# EAGLE schematic project arm stm32f103 (EAGLE 7.1.0)
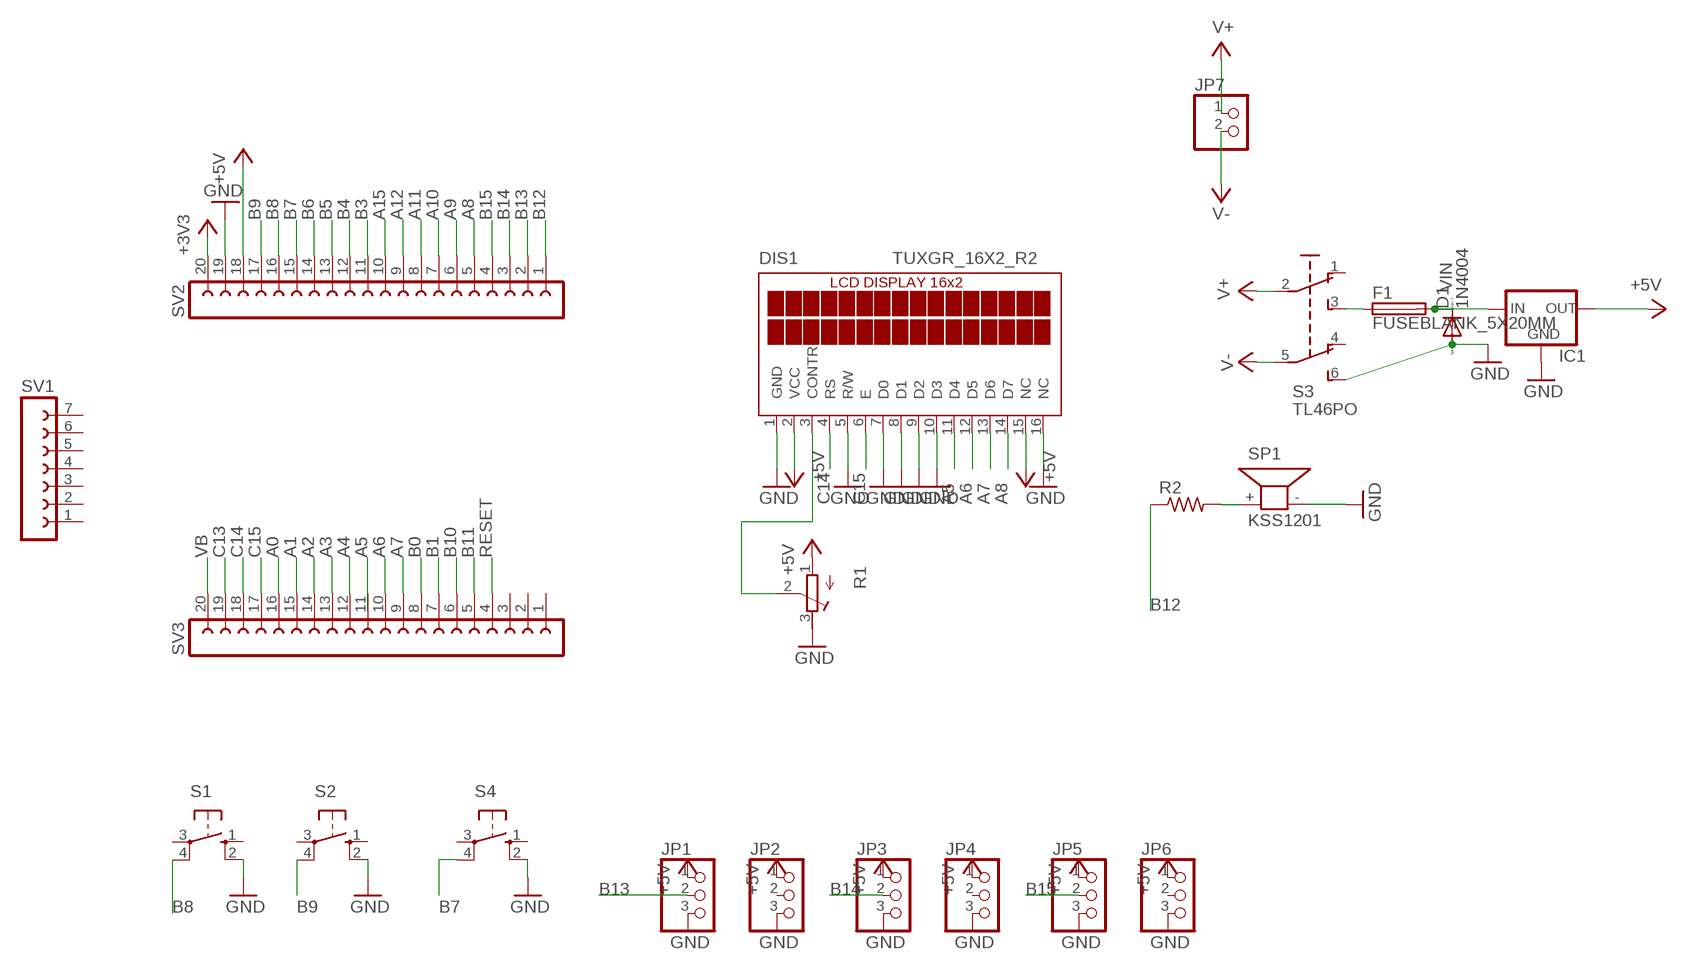
[diagram p0: schematic, sheet 1]

## Parts
D1  1N4004  [DO41-10]
DIS1  TUXGR_16X2_R2  [TUXGR_16X2_R2]
F1  FUSEBLANK_5X20MM  [FUSE_HOLDER_5X20MM]
IC1  78XXL  [78XXL]
JP1  PINHD-1X3  [1X03]
JP2  PINHD-1X3  [1X03]
JP3  PINHD-1X3  [1X03]
JP4  PINHD-1X3  [1X03]
JP5  PINHD-1X3  [1X03]
JP6  PINHD-1X3  [1X03]
JP7  PINHD-1X2  [1X02]
R1  R-TRIMM3339P  [RTRIM3339P]
R2  R-US_0204/7  [0204/7]
S1  10-XX  [B3F-10XX]
S2  10-XX  [B3F-10XX]
S3  TL46PO  [TL4XPO]
S4  10-XX  [B3F-10XX]
SP1  KSS1201  [KSS1201]
SV1  FE07-1  [FE07]
SV2  FE20-1  [FE20]
SV3  FE20-1  [FE20]

## Nets
+3V3: SV2.20
+5V: DIS1.2(VCC) DIS1.15(NC) IC1.OUT JP1.1 JP2.1 JP3.1 JP4.1 JP5.1 JP6.1 R1.1(E) SV2.18
A0: SV3.16
A1: SV3.15
A2: SV3.14
A3: SV3.13
A4: SV3.12
A5: DIS1.11(D4)
A6: DIS1.12(D5) SV3.10
A7: DIS1.13(D6) SV3.9
A8: DIS1.14(D7) SV2.5
A9: SV2.6
A10: SV2.7
A11: SV2.8
A12: SV2.9
A15: SV2.10
B0: SV3.8
B1: SV3.7
B3: SV2.11
B4: SV2.12
B5: SV2.13
B6: SV2.14
B7: S4.4(P1) SV2.15
B8: S1.4(P1) SV2.16
B9: S2.4(P1) SV2.17
B10: SV3.6
B11: SV3.5
B12: R2.1 SV2.1
B13: JP1.2 SV2.2
B14: JP3.2 SV2.3
B15: JP5.2 SV2.4
C13: SV3.19
C14: DIS1.4(RS) SV3.18
C15: DIS1.6(E) SV3.17
GND: D1.A DIS1.1(GND) DIS1.5(R/W) DIS1.7(D0) DIS1.8(D1) DIS1.9(D2) DIS1.10(D3) DIS1.16(NC) IC1.GND JP1.3 JP2.3 JP3.3 JP4.3 JP5.3 JP6.3 R1.3(A) S1.2(S1) S2.2(S1) S3.6(S1) S4.2(S1) SP1.- SV2.19
N$1: R2.2 SP1.+
N$2: F1.1 S3.3(S)
N$3: DIS1.3(CONTR) R1.2(S)
RESET: SV3.4
V+: JP7.1 S3.2(P)
V-: JP7.2 S3.5(P1)
VB: SV3.20
VIN: D1.C F1.2 IC1.IN
Unconnected: JP2.2 JP4.2 JP6.2 S1.1(S) S1.3(P) S2.1(S) S2.3(P) S3.1(O) S3.4(O1) S4.1(S) S4.3(P) SV1.1 SV1.2 SV1.3 SV1.4 SV1.5 SV1.6 SV1.7 SV3.1 SV3.2 SV3.3 SV3.11

## Library data of the parts
D1 = diode:1N4004: DIODE general purpose rectifier, 1 A
DIS1 = display-lcd:TUXGR_16X2_R2: Tuxgraphics LCD display 16x2 characters reflective, without background light Source: tuxgr_12x2_r2.pdf; OC_FARNELL: unknown; OC_NEWARK: unknown
F1 = fuse:FUSE: Fuse; OC_FARNELL: unknown; OC_NEWARK: unknown
IC1 = v-reg:78XXL: VOLTAGE REGULATOR
JP1-JP6 = pinhead:PINHD-1X3: PIN HEADER
JP7 = pinhead:PINHD-1X2: PIN HEADER
R1 = resistor:R-TRIMM: Trimm resistor
R2 = rcl:R-US_: RESISTOR, American symbol
S1 S2 S4 = switch-omron:10-XX: OMRON SWITCH; MPN: B3F-1000; OC_FARNELL: 176432; OC_NEWARK: 36M3542
S3 = switch:TL46PO: TINY SWITCH ON - ON Source: http://www2.produktinfo.conrad.com/datenblaetter/700000-724999/705152-da-01-de-Subminiaturschalter_TL_36YO.pdf
SP1 = buzzer:KSS1201: SPEAKER Source: Schukat; OC_FARNELL: unknown; OC_NEWARK: unknown
SV1 = con-lsta:FE07-1: FEMALE HEADER; OC_FARNELL: unknown; OC_NEWARK: unknown
SV2 SV3 = con-lsta:FE20-1: FEMALE HEADER; OC_FARNELL: unknown; OC_NEWARK: unknown